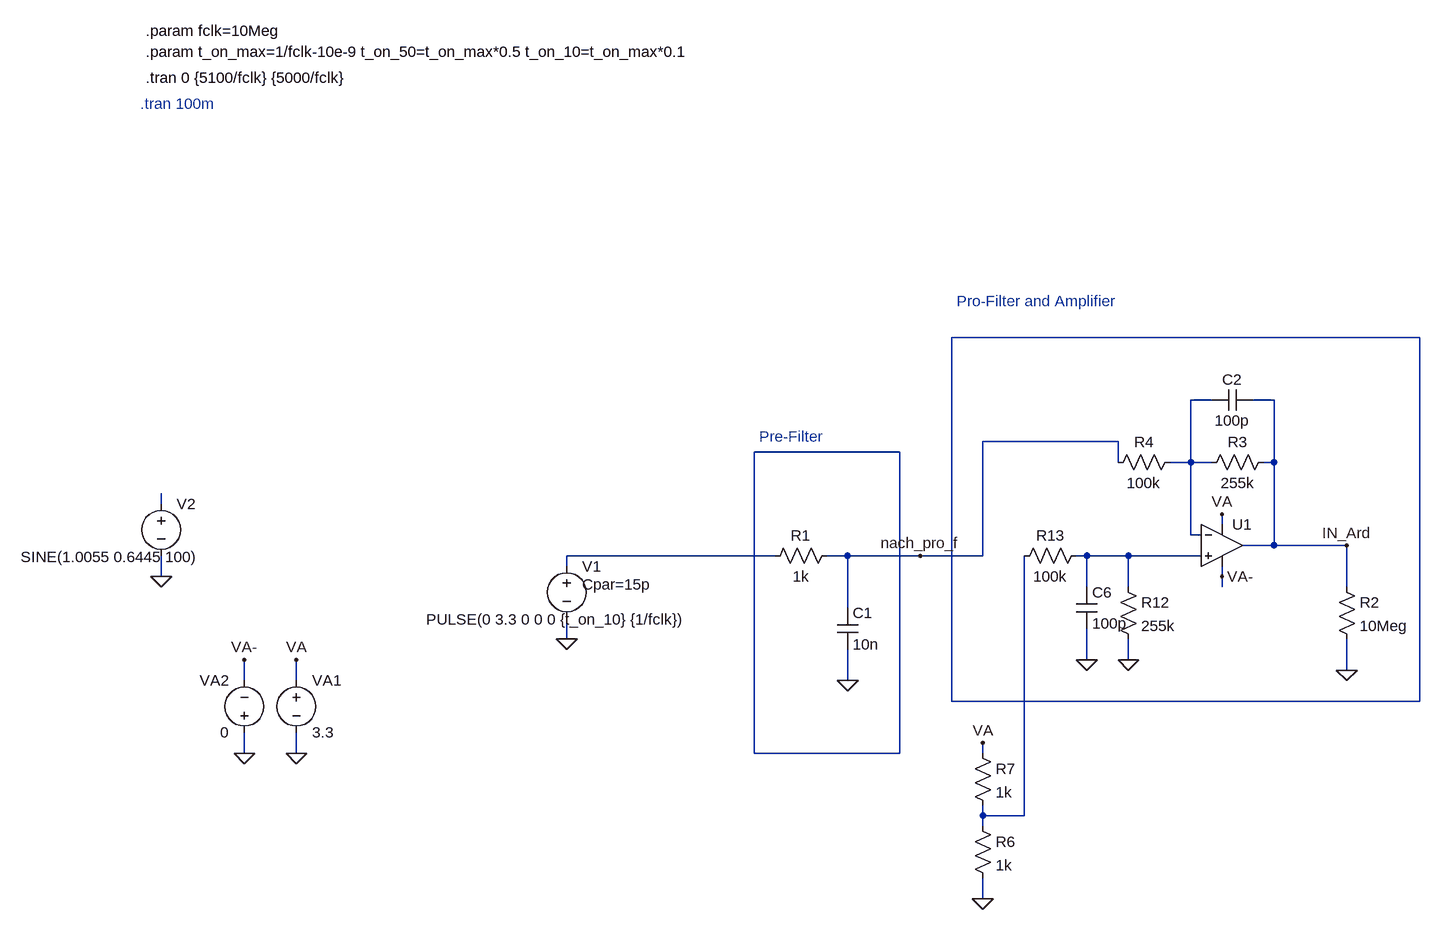
[diagram p0: schematic StromMessung_einfacher.asc]
StromMessung_einfacher.asc, the LTspice schematic file:
Version 4
SHEET 1 880 1268
WIRE 576 -208 -144 -208
WIRE 256 -112 224 -112
WIRE 352 -112 320 -112
WIRE 112 -48 -96 -48
WIRE -224 -32 -448 -32
WIRE 112 -16 112 -48
WIRE 224 -16 224 -112
WIRE 224 -16 192 -16
WIRE 256 -16 224 -16
WIRE 352 -16 352 -112
WIRE 352 -16 336 -16
WIRE -1360 48 -1360 32
WIRE 272 80 272 64
WIRE 224 96 224 -16
WIRE 240 96 224 96
WIRE 352 112 352 -16
WIRE 352 112 304 112
WIRE 464 112 352 112
WIRE -416 128 -736 128
WIRE -304 128 -336 128
WIRE -192 128 -304 128
WIRE -96 128 -96 -48
WIRE -96 128 -192 128
WIRE 64 128 48 128
WIRE 128 128 64 128
WIRE 240 128 128 128
WIRE -736 144 -736 128
WIRE -1360 160 -1360 128
WIRE 272 160 272 144
WIRE 64 176 64 128
WIRE 128 176 128 128
WIRE 272 176 272 160
WIRE 464 176 464 112
WIRE -304 208 -304 128
WIRE -736 256 -736 224
WIRE 64 288 64 240
WIRE 128 288 128 256
WIRE 464 304 464 256
WIRE -1232 320 -1232 288
WIRE -1152 320 -1152 288
WIRE -304 320 -304 272
WIRE -144 352 -144 -208
WIRE 576 352 576 -208
WIRE 576 352 -144 352
WIRE -1232 432 -1232 400
WIRE -1152 432 -1152 400
WIRE -448 432 -448 -32
WIRE -224 432 -224 -32
WIRE -224 432 -448 432
WIRE -96 432 -96 416
WIRE -96 528 -96 512
WIRE -32 528 -32 128
WIRE -32 528 -96 528
WIRE -96 544 -96 528
WIRE -96 656 -96 624
FLAG -304 320 0
FLAG 464 304 0
FLAG 272 64 VA
FLAG 272 160 VA-
FLAG -96 656 0
FLAG 464 112 IN_Ard
FLAG -736 256 0
FLAG -1152 432 0
FLAG -1152 288 VA
FLAG -1232 432 0
FLAG -1232 288 VA-
FLAG -96 416 VA
FLAG -192 128 nach_pro_f
FLAG 128 288 0
FLAG 64 288 0
FLAG -1360 160 0
SYMBOL res -320 112 R90
WINDOW 0 0 56 VBottom 2
WINDOW 3 32 56 VTop 2
SYMATTR InstName R1
SYMATTR Value 1k
SYMBOL cap -320 208 R0
SYMATTR InstName C1
SYMATTR Value 10n
SYMBOL res 448 160 R0
SYMATTR InstName R2
SYMATTR Value 10Meg
SYMBOL res 352 -32 R90
WINDOW 0 0 56 VBottom 2
WINDOW 3 32 56 VTop 2
SYMATTR InstName R3
SYMATTR Value 255k
SYMBOL res 208 -32 R90
WINDOW 0 0 56 VBottom 2
WINDOW 3 32 56 VTop 2
SYMATTR InstName R4
SYMATTR Value 100k
SYMBOL cap 320 -128 R90
WINDOW 0 0 32 VBottom 2
WINDOW 3 32 32 VTop 2
SYMATTR InstName C2
SYMATTR Value 100p
SYMBOL voltage -736 128 R0
WINDOW 3 -216 98 Left 2
WINDOW 123 0 0 Left 0
WINDOW 39 24 44 Left 2
SYMATTR Value PULSE(0 3.3 0 0 0 {t_on_10} {1/fclk})
SYMATTR SpiceLine Cpar=15p
SYMATTR InstName V1
SYMBOL voltage -1152 304 R0
WINDOW 123 0 0 Left 0
WINDOW 39 0 0 Left 0
SYMATTR InstName VA1
SYMATTR Value 3.3
SYMBOL voltage -1232 416 R180
WINDOW 0 24 96 Left 2
WINDOW 3 24 16 Left 2
WINDOW 123 0 0 Left 0
WINDOW 39 0 0 Left 0
SYMATTR InstName VA2
SYMATTR Value 0
SYMBOL res -112 528 R0
SYMATTR InstName R6
SYMATTR Value 1k
SYMBOL res -112 416 R0
SYMATTR InstName R7
SYMATTR Value 1k
SYMBOL res 112 160 R0
SYMATTR InstName R12
SYMATTR Value 255k
SYMBOL cap 48 176 R0
SYMATTR InstName C6
SYMATTR Value 100p
SYMBOL res 64 112 R90
WINDOW 0 0 56 VBottom 2
WINDOW 3 32 56 VTop 2
SYMATTR InstName R13
SYMATTR Value 100k
SYMBOL OpAmps\\UniversalOpAmp2 272 112 R0
SYMATTR InstName U1
SYMBOL voltage -1360 32 R0
WINDOW 3 -216 98 Left 2
WINDOW 123 0 0 Left 0
WINDOW 39 0 0 Left 0
SYMATTR Value SINE(1.0055 0.6445 100)
SYMATTR InstName V2
TEXT -440 -56 Left 2 ;Pre-Filter
TEXT -136 -264 Left 2 ;Pro-Filter and Amplifier
TEXT -1384 -608 Left 2 !.tran 0 {5100/fclk} {5000/fclk}
TEXT -1384 -648 Left 2 !.param t_on_max=1/fclk-10e-9 t_on_50=t_on_max*0.5 t_on_10=t_on_max*0.1
TEXT -1384 -680 Left 2 !.param fclk=10Meg
TEXT -1392 -568 Left 2 ;.tran 100m

The netlist it stands for:
* StromMessung_einfacher.asc
R1 nach_pro_f N005 1k
C1 nach_pro_f 0 10n
R2 IN_Ard 0 10Meg
R3 IN_Ard N002 255k
R4 N002 nach_pro_f 100k
C2 IN_Ard N002 100p
V1 N005 0 PULSE(0 3.3 0 0 0 {t_on_10} {1/fclk}) Cpar=15p
VA1 VA 0 3.3
VA2 0 VA- 0
R6 N007 0 1k
R7 VA N007 1k
R12 N006 0 255k
C6 N006 0 100p
R13 N006 N007 100k
XU1 N006 N002 VA VA- IN_Ard level2 Avol=1Meg GBW=10Meg Slew=10Meg Ilimit=25m Rail=0 Vos=0 En=0 Enk=0 In=0 Ink=0 Rin=500Meg  ; pins In+ In- V+ V- OUT
V2 N004 0 SINE(1.0055 0.6445 100)
* Pre-Filter
* Pro-Filter and Amplifier
.tran 0 {5100/fclk} {5000/fclk}
.param t_on_max=1/fclk-10e-9 t_on_50=t_on_max*0.5 t_on_10=t_on_max*0.1
.param fclk=10Meg
* .tran 100m
.lib UniversalOpAmp2.lib
.backanno
.end